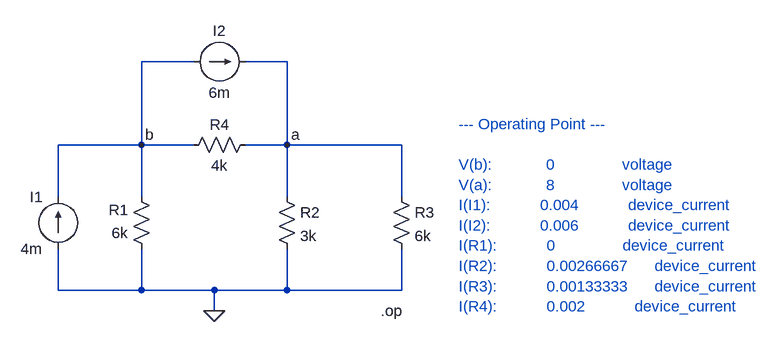
[diagram p0: schematic Q1LT.asc]
Q1LT.asc, the LTspice schematic file:
Version 4
SHEET 1 1280 680
WIRE 368 -32 288 -32
WIRE 512 -32 448 -32
WIRE 288 96 288 -32
WIRE 288 96 160 96
WIRE 368 96 288 96
WIRE 512 96 512 -32
WIRE 512 96 448 96
WIRE 688 96 512 96
WIRE 160 176 160 96
WIRE 288 176 288 96
WIRE 512 176 512 96
WIRE 688 176 688 96
WIRE 160 320 160 256
WIRE 288 320 288 256
WIRE 288 320 160 320
WIRE 400 320 288 320
WIRE 512 320 512 256
WIRE 512 320 400 320
WIRE 688 320 688 256
WIRE 688 320 512 320
WIRE 400 352 400 320
FLAG 400 352 0
FLAG 288 96 b
FLAG 512 96 a
SYMBOL current 160 256 R180
WINDOW 0 24 80 Left 2
WINDOW 3 24 0 Left 2
SYMATTR InstName I1
SYMATTR Value 4m
SYMBOL current 368 -32 R270
WINDOW 0 32 40 VTop 2
WINDOW 3 -32 40 VBottom 2
SYMATTR InstName I2
SYMATTR Value 6m
SYMBOL res 304 272 R180
WINDOW 0 36 76 Left 2
WINDOW 3 36 40 Left 2
SYMATTR InstName R1
SYMATTR Value 6k
SYMBOL res 496 160 R0
SYMATTR InstName R2
SYMATTR Value 3k
SYMBOL res 672 160 R0
SYMATTR InstName R3
SYMATTR Value 6k
SYMBOL res 464 80 R90
WINDOW 0 0 56 VBottom 2
WINDOW 3 32 56 VTop 2
SYMATTR InstName R4
SYMATTR Value 4k
TEXT 656 352 Left 2 !.op
TEXT 776 64 Left 2 ;--- Operating Point ---\n \nV(b):            0               voltage\nV(a):            8               voltage\nI(I1):           0.004           device_current\nI(I2):           0.006           device_current\nI(R1):           0               device_current\nI(R2):           0.00266667      device_current\nI(R3):           0.00133333      device_current\nI(R4):           0.002           device_current

The netlist it stands for:
* Q1LT.asc
I1 0 b 4m
I2 b a 6m
R1 0 b 6k
R2 a 0 3k
R3 a 0 6k
R4 a b 4k
.op
* --- Operating Point ---
* V(b):            0               voltage
* V(a):            8               voltage
* I(I1):           0.004           device_current
* I(I2):           0.006           device_current
* I(R1):           0               device_current
* I(R2):           0.00266667      device_current
* I(R3):           0.00133333      device_current
* I(R4):           0.002           device_current
.backanno
.end